# Altium schematic sheet MAG.SchDoc
size A4; SheetNumber: 7; SheetTotal: 8
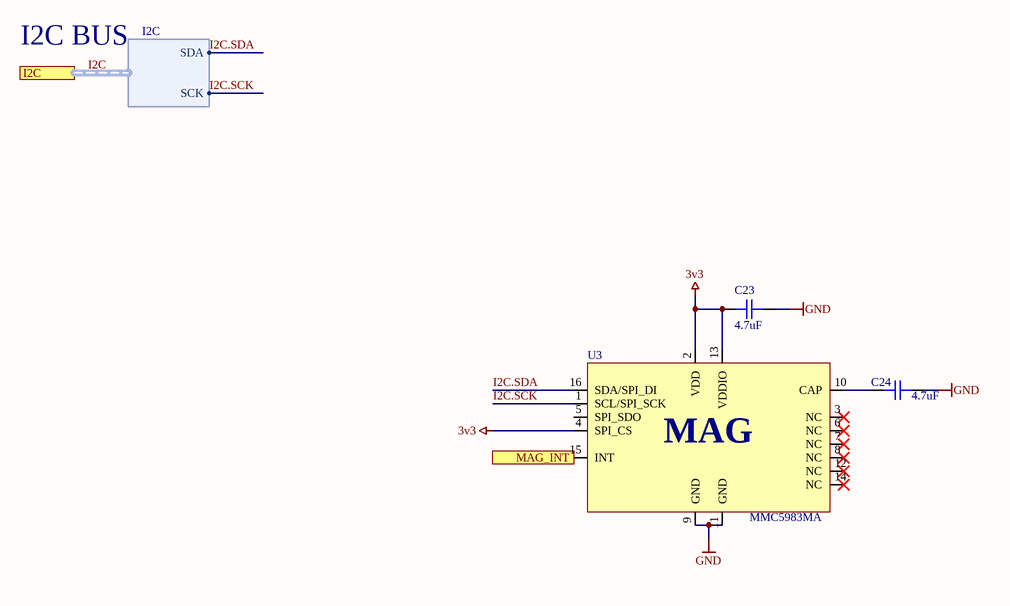
[diagram p0: MAG.SchDoc]

## Parts
C23  value 4.7uF  [CAP_0402]  (hidden comment: C0402_10V)
C24  value 4.7uF  [CAP_0402]  (hidden comment: C0402_10V)
U3  MMC5983MA  [MMC5983MA-LGA]

## Ports
I2C (harness I2C, see Top Level Organization[3B], ESP[1A], IMU[1A]), MAG_INT (out, see Top Level Organization[3C], ESP[4C])

## Harnesses
I2C: SDA, SCK

## Nets
3v3: C23.2 U3.2(VDD) U3.4(SPI_CS) U3.13(VDDIO)
GND: C23.1 C24.2 U3.9(GND) U3.11(GND)
I2C.SCK: U3.1(SCL/SPI_SCK) ; port I2C.SCK
I2C.SDA: U3.16(SDA/SPI_DI) ; port I2C.SDA
MAG_INT: U3.15(INT) ; port MAG_INT
NetC24_1: C24.1 U3.10(CAP)

Not connected (* = marked no-connect by the designer): U3 3(NC)* 5(SPI_SDO) 6(NC)* 7(NC)* 8(NC)* 12(NC)* 14(NC)*

## Buses and harness runs
harness I2C = port I2C

## Notes on the sheet
- I2C BUS
- (in symbol MMC5983MA) MAG

## Library data of the parts
C23 C24 = CAP_0402_10V: Capacitor SMD 0402 10V
U3 = MMC5983MA: ±8 Gauss, High Performance 3-axis Magnetic Sensor I2C/SPI; Manufacturer: MEMSIC; Manufacturer Part Number: MMC5983MA